# EAGLE design Pi-XO (EAGLE 9.2.2)
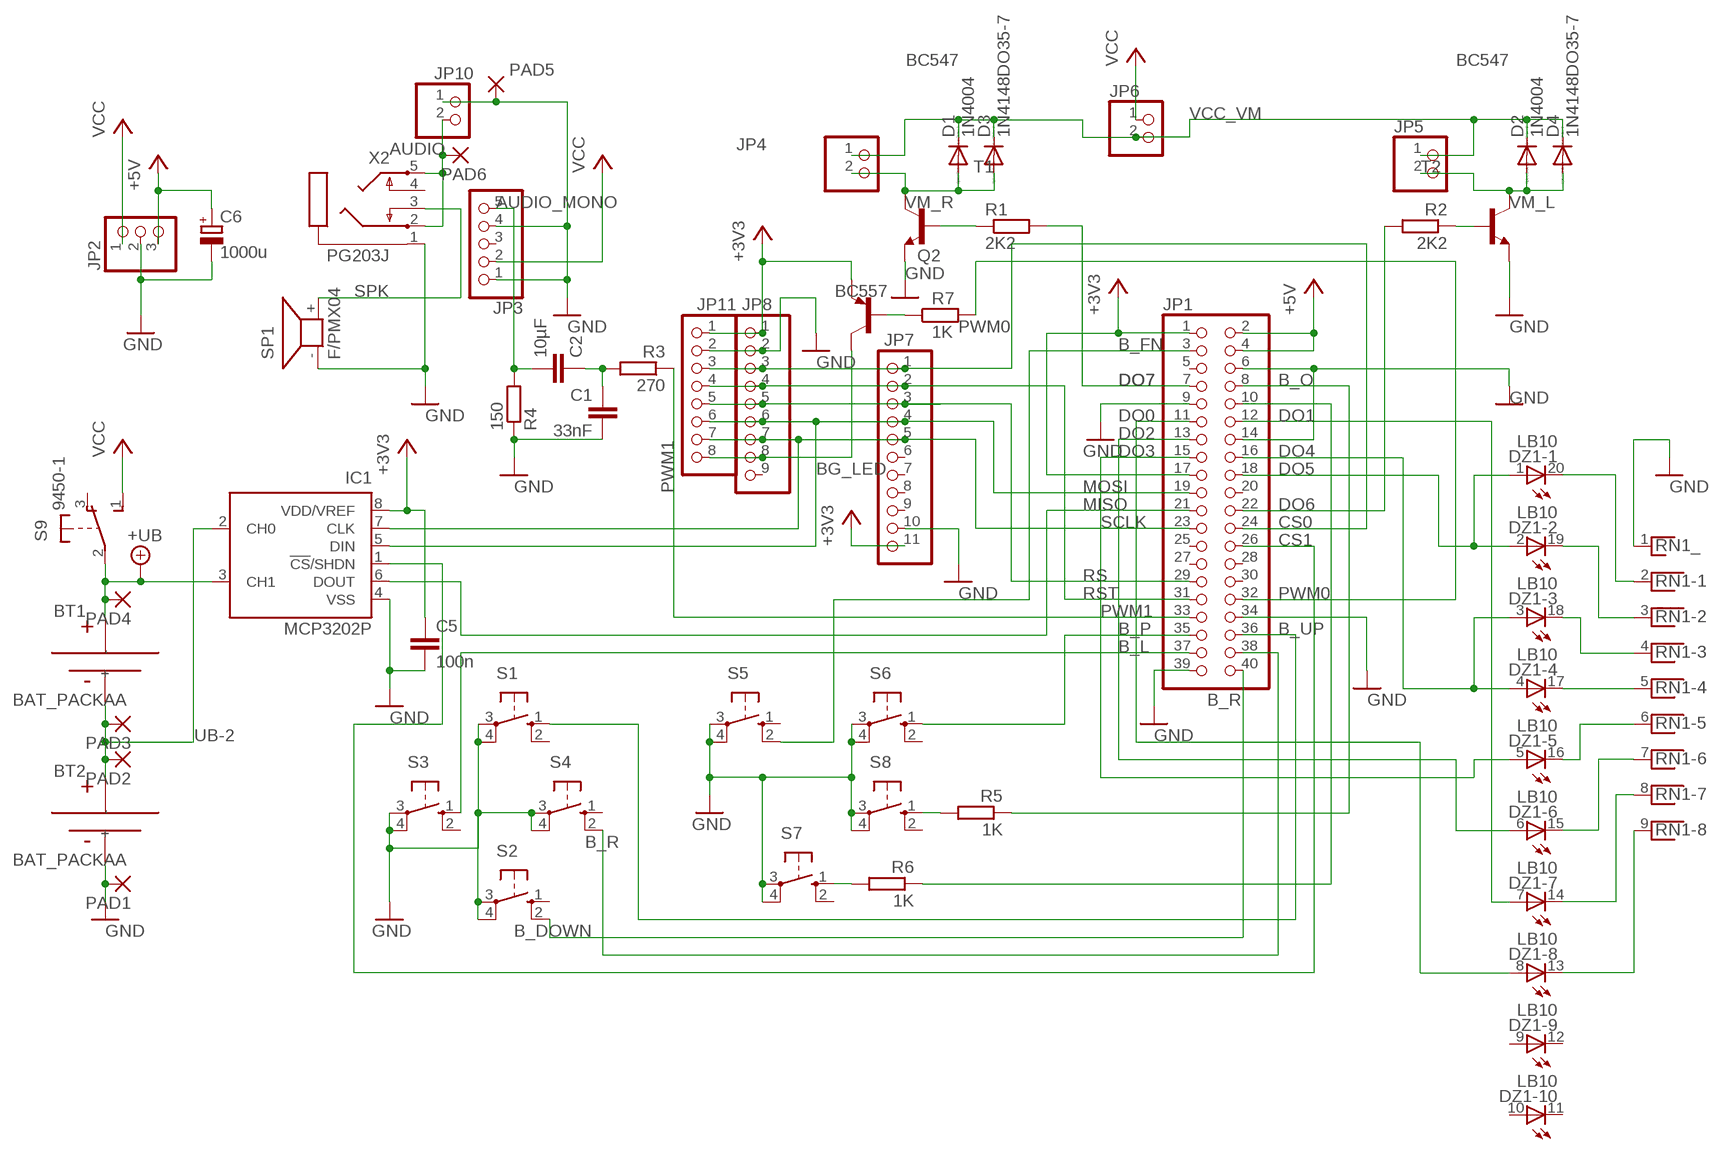
[diagram p0: schematic, sheet 1]

## Parts
BT1  BAT_PACKAA  [BHAA-3]
BT2  BAT_PACKAA  [BHAA-3]
C1  33nF  C-EU050-024X044  [C050-024X044]
C2  10µF  C-EU050-024X044  [C050-024X044]
C5  100n  C-EU025-030X050  [C025-030X050]
C6  1000u  CPOL-EUB45181A  [B45181A]
D1  1N4004  [DO41-10]
D2  1N4004  [DO41-10]
D3  1N4148DO35-7  [DO35-7]
D4  1N4148DO35-7  [DO35-7]
DZ1  LB10  [LB10]
IC1  MCP3202P  [DIL8]
JP1  PINHD-2X20  [2X20]
JP2  PINHD-1X3  [1X03]
JP3  PINHD-1X5  [1X05]
JP4  PINHD-1X2  [1X02]
JP5  PINHD-1X2  [1X02]
JP6  PINHD-1X2  [1X02]
JP7  PINHD-1X11  [1X11]
JP8  PINHD-1X9  [1X09]
JP10  PINHD-1X2  [1X02]
JP11  PINHD-1X8  [1X08]
PAD1  3,81/1,4  [3,81/1,4]
PAD2  3,81/1,4  [3,81/1,4]
PAD3  3,81/1,4  [3,81/1,4]
PAD4  3,81/1,4  [3,81/1,4]
PAD5  2,15/1,0  [2,15/1,0]
PAD6  2,15/1,0  [2,15/1,0]
Q2  BC557  [TO92]
R1  2K2  R-EU_0204/7  [0204/7]
R2  2K2  R-EU_0204/7  [0204/7]
R3  270  R-EU_0204/7  [0204/7]
R4  150  R-EU_0204/7  [0204/7]
R5  1K  R-EU_0204/7  [0204/7]
R6  1K  R-EU_0204/7  [0204/7]
R7  1K  R-EU_0204/7  [0204/7]
RN1  RNX8  [RN-9]
S1  10-XX  [B3F-10XX]
S2  10-XX  [B3F-10XX]
S3  10-XX  [B3F-10XX]
S4  10-XX  [B3F-10XX]
S5  10-XX  [B3F-10XX]
S6  10-XX  [B3F-10XX]
S7  10-XX  [B3F-10XX]
S8  10-XX  [B3F-10XX]
S9  9450-1  [9450-1]
SP1  F/PMX04  [F/PMX04A]
T1  BC547  [TO92]
T2  BC547  [TO92]
X2  PG203J  [PG203J]

## Nets
+3V3 [Low Power Supply]: C5.1 IC1.8(VDD/VREF) JP1.1 JP1.17 JP7.11 JP8.1 JP11.1 Q2.1(E)
+5V [Supply]: C6.+ JP1.2 JP1.4 JP2.3
+UB [Low Power Supply]: BT1.+ IC1.3(CH1) PAD4.1(P) S9.2(P)
AUDIO [Audio]: JP10.2 PAD6.1(P) X2.2 X2.5
AUDIO_MONO [Audio]: C2.2 JP3.5 R4.2
B_DOWN: JP1.40 S2.2(S1)
B_FN: JP1.3 S5.2(S1)
B_L: JP1.37 S3.1(S)
B_O: JP1.8 R5.1
B_P: JP1.35 S6.1(S)
B_R: JP1.38 S4.2(S1)
B_UP: JP1.36 S1.1(S)
B_X: JP1.10 R6.1
BG_LED: JP8.8 JP11.8 Q2.3(C)
CS0: JP1.24 JP7.1 JP8.3 JP11.3
CS1: IC1.1(!CS!/SHDN) JP1.26
DO0: DZ1.8(-8:A) JP1.11
DO1: DZ1.7(-7:A) JP1.12
DO2: DZ1.6(-6:A) JP1.13
DO3: DZ1.5(-5:A) JP1.15
DO4: DZ1.3(-3:A) DZ1.4(-4:A) JP1.16
DO5: DZ1.1(-1:A) DZ1.2(-2:A) JP1.18
DO6: JP1.22 R2.2
DO7: JP1.7 R1.2
GND [Supply]: BT2.- C1.2 C5.2 C6.- IC1.4(VSS) JP1.6 JP1.9 JP1.14 JP1.34 JP1.39 JP2.2 JP3.1 JP3.4 JP7.10 JP8.2 JP10.1 JP11.2 PAD1.1(P) PAD5.1(P) R4.1 RN1.1 S1.3(P) S1.4(P1) S2.3(P) S2.4(P1) S3.3(P) S3.4(P1) S4.3(P) S4.4(P1) S5.3(P) S5.4(P1) S6.3(P) S6.4(P1) S7.3(P) S7.4(P1) S8.3(P) S8.4(P1) SP1.- T1.1(E) T2.1(E) X2.1
MISO: IC1.6(DOUT) JP1.21
MOSI: IC1.5(DIN) JP1.19 JP7.4 JP8.6 JP11.6
N$2: C1.1 C2.1 R3.2
N$3: R1.1 T1.2(B)
N$6: R2.1 T2.2(B)
N$10: DZ1.20(-1:C) RN1.2
N$11: DZ1.19(-2:C) RN1.3
N$12: DZ1.18(-3:C) RN1.4
N$13: DZ1.17(-4:C) RN1.5
N$14: DZ1.16(-5:C) RN1.6
N$15: DZ1.15(-6:C) RN1.7
N$16: DZ1.14(-7:C) RN1.8
N$17: DZ1.13(-8:C) RN1.9
N$31: R5.2 S8.1(S)
N$34: R6.2 S7.1(S)
N$43: Q2.2(B) R7.1
PWM0: JP1.32 R7.2
PWM1 [Audio]: JP1.33 R3.1
RS: JP1.29 JP7.3 JP8.5 JP11.5
RST: JP1.31 JP7.2 JP8.4 JP11.4
SCLK: IC1.7(CLK) JP1.23 JP7.5 JP8.7 JP11.7
SPK [Audio]: SP1.+ X2.3
UB-2 [Supply]: BT1.- BT2.+ IC1.2(CH0) PAD2.1(P) PAD3.1(P)
VCC [Supply]: JP2.1 JP3.2 JP6.1 S9.1(S)
VCC_VM: D1.C D2.C D3.C D4.C JP4.1 JP5.1 JP6.2
VM_L: D2.A D4.A JP5.2 T2.3(C)
VM_R: D1.A D3.A JP4.2 T1.3(C)
Unconnected: DZ1.9(-9:A) DZ1.10(-10:A) DZ1.11(-10:C) DZ1.12(-9:C) JP1.5 JP1.20 JP1.25 JP1.27 JP1.28 JP1.30 JP3.3 JP7.6 JP7.7 JP7.8 JP7.9 JP8.9 S1.2(S1) S2.1(S) S3.2(S1) S4.1(S) S5.1(S) S6.2(S1) S7.2(S1) S8.2(S1) S9.3(O) X2.4

## Library data of the parts
BT1 BT2 = batteries2-eagle9:BAT_PACK: collection of battery footprints; DIGIKEY: BHAA-3-ND; MANUFACTURER: MPD; MPN: BHAA-3
C1 C2 C5 = rcl:C-EU: CAPACITOR, European symbol; SPICEPREFIX: C
C6 = rcl:CPOL-EU: POLARIZED CAPACITOR, European symbol; SPICEPREFIX: C
D1 D2 = diode:1N4004: DIODE general purpose rectifier, 1 A
D3 D4 = diode:1N4148: DIODE high speed (Philips)
DZ1 = led:LB10: LED BLOCK 10-LED bar graph, DIL, Siemens
IC1 = microchip:MCP3202: 2.7V Dual Channel 12-Bit A/D Converter with SPI Serial Interface Source: http://ww1.microchip.com/downloads/en/DeviceDoc/21034D.pdf; MF: MICROCHIP; MPN: MCP3202-CI/P; OC_FARNELL: 1196794; OC_NEWARK: 72K7287
JP1 = pinhead:PINHD-2X20: PIN HEADER
JP2 = pinhead:PINHD-1X3: PIN HEADER
JP3 = pinhead:PINHD-1X5: PIN HEADER
JP4-JP6 JP10 = pinhead:PINHD-1X2: PIN HEADER
JP7 = pinhead:PINHD-1X11: PIN HEADER
JP8 = pinhead:PINHD-1X9: PIN HEADER
JP11 = pinhead:PINHD-1X8: PIN HEADER
PAD1-PAD4 = wirepad:3,81/1,4: THROUGH-HOLE PAD
PAD5 PAD6 = wirepad:2,15/1,0: THROUGH-HOLE PAD
Q2 = transistor-pnp:BC557: PNP Transistor
R1-R7 = rcl:R-EU_: RESISTOR, European symbol; SPICEPREFIX: R
RN1 = resistor-net:RNX8: RESISTOR NETWORK; OC_FARNELL: unknown; OC_NEWARK: unknown
S1-S8 = switch-omron:10-XX: OMRON SWITCH; MPN: B3F-1000; OC_FARNELL: 176432; OC_NEWARK: 36M3542
S9 = switch-misc:9450-1: MARQUARDT SWITCH
SP1 = buzzer:F/PMX04: SPEAKER Source: Buerklin; OC_FARNELL: unknown; OC_NEWARK: unknown
T1 T2 = transistor:BC547: NPN TRANSISTOR
X2 = con-hirschmann:PG203J: MIC/HEADPHONE JACK KS-S stereo microphone/headphone jack PG203JN (Schukat); OC_FARNELL: unknown; OC_NEWARK: unknown

## Net classes
1 Supply: width 0.25 mm, drill 0.1 mm, clearance 0.25 mm
2 Low Power Supply: width 0.25 mm, drill 0.008 mm, clearance 0.2 mm
3 Audio: clearance 0.3 mm

## Board
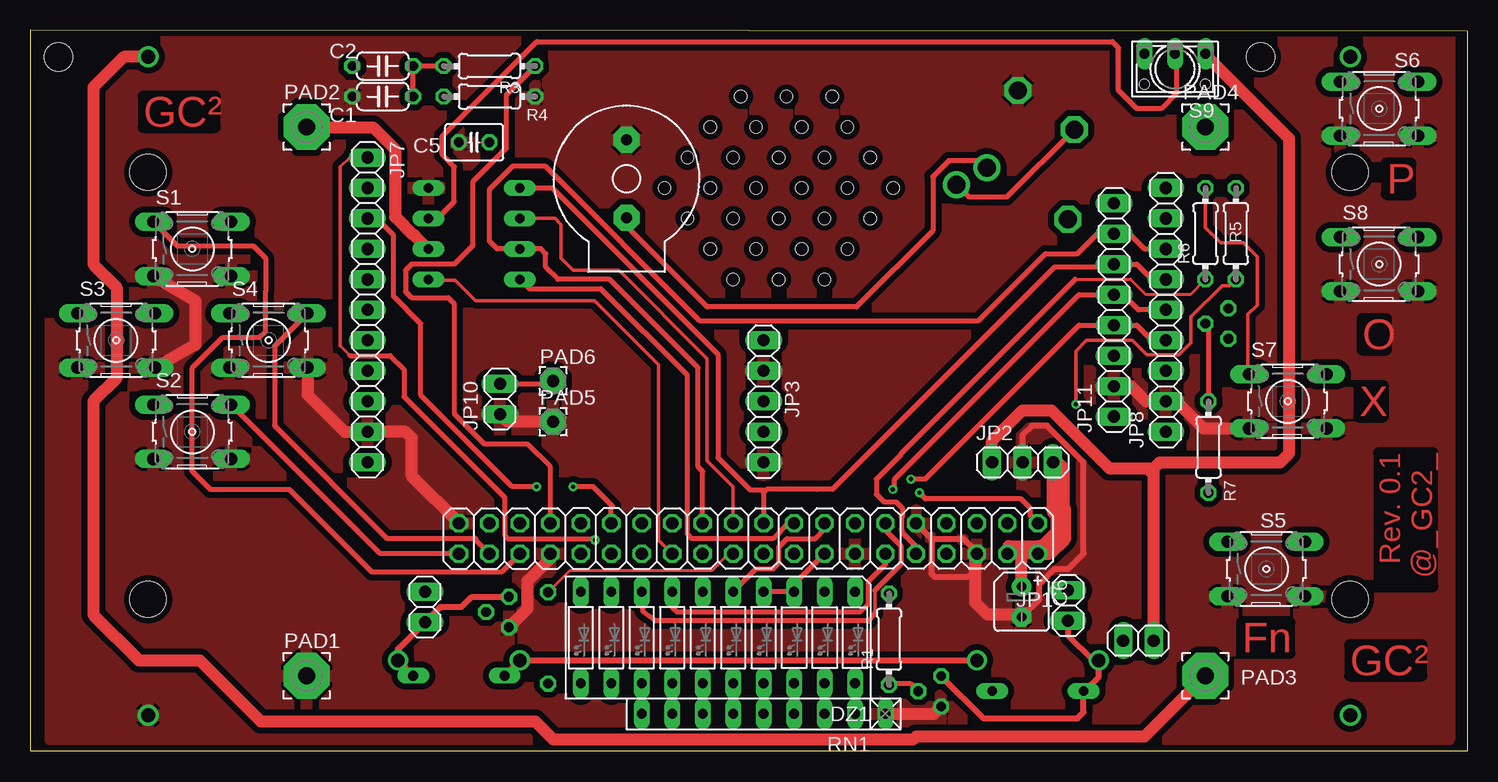
[diagram p1: board, top side]
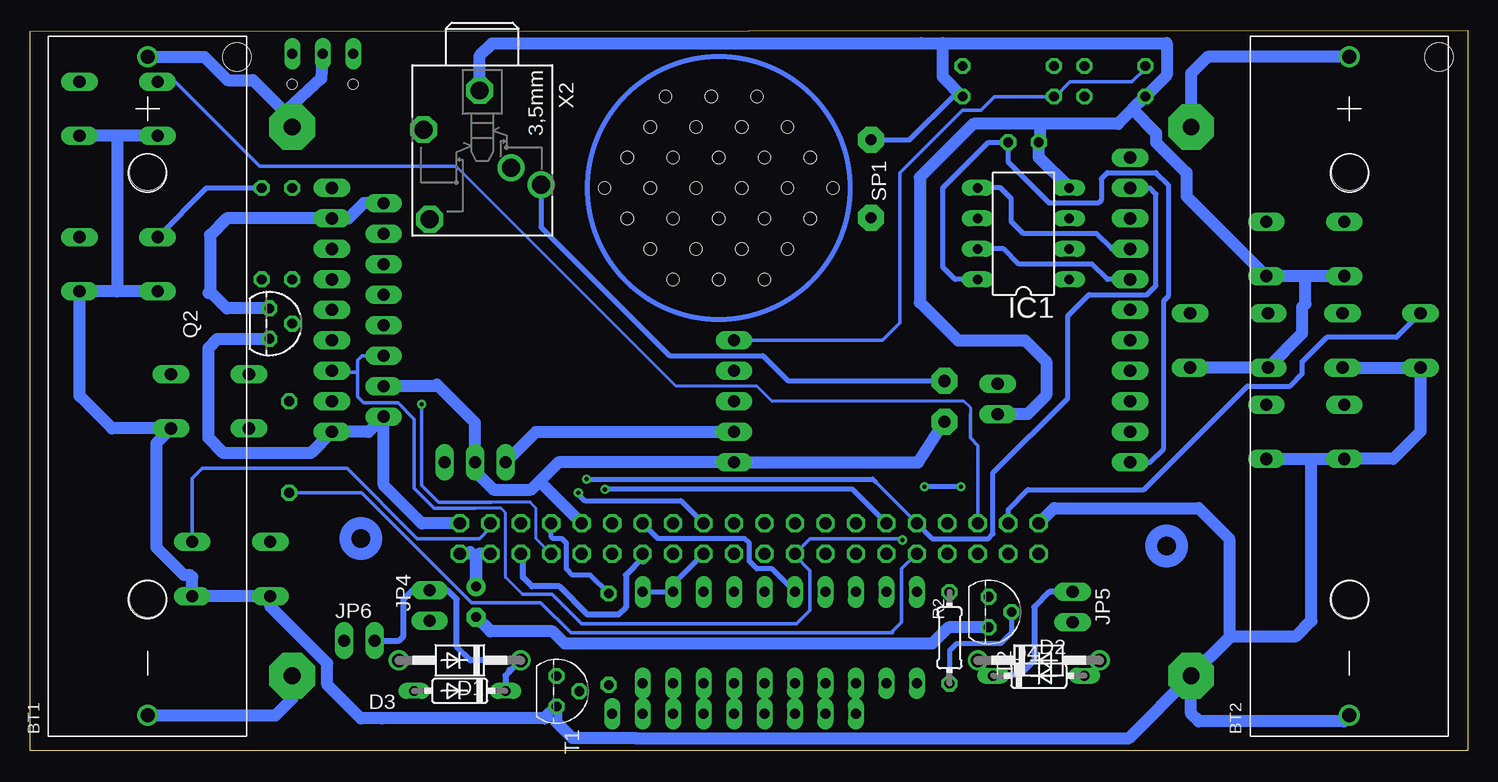
[diagram p2: board, bottom side, seen from below]

Size 119.84 x 60.05 mm. Coordinates in mm from the lower left corner, seen from the top.
Outline: 0,0 119.84,0 119.84,59.95 0,60.05 0,0
Copper layers (1*16): Top 0.035mm / dielectric 1.5mm / Bottom 0.035mm
Design rules "default *": minimum track width 6mil, minimum drill 0.35mm, track to track 6mil, track to pad 6mil, pad to pad 6mil, via to via 6mil, smd to smd 6mil, copper to edge 10mil, drill to drill 1mil, minimum pad ring 10mil, minimum via ring 8mil, stop-mask expansion 4mil, vias tented up to drill 0mil, thermal gap 10mil
Holes 3 mm at 110.04,48.21 110.04,12.61 9.84,12.61 9.84,48.21
Holes 1 mm at 56.71,51.97 60.52,51.97 64.33,51.97 68.14,51.97 66.87,54.51 63.06,54.51 59.25,54.51 70.05,49.43 66.23,49.43 62.43,49.43 58.62,49.43 54.8,49.43 56.71,46.89 60.52,46.89 64.33,46.89 68.14,46.89 70.05,44.35 66.23,44.35 62.43,44.35 58.62,44.35 54.8,44.35 56.71,41.81 60.52,41.81 64.33,41.81 68.14,41.81 66.23,39.27 62.43,39.27 58.62,39.27 52.9,46.89 71.95,46.89

### Footprints (pad centres in the part's own frame; a part is rotated, then mirrored left to right if it is on the bottom)
BHAA-3 = drill 1.17: + 27.43,0; - -27.43,0 | hole 2.36: 27.43,-7.47
C050-024X044 = drill 0.813 octagon: 1 -2.54,0; 2 2.54,0
C025-030X050 = drill 0.813 octagon: 1 -1.27,0; 2 1.27,0
B45181A = drill 0.813 pad 1.6: + -1.27,0 | drill 0.813 pad 1.6 octagon: - 1.27,0
DO41-10 = drill 1.118: A 5.08,0; C -5.08,0
DO35-7 = drill 0.813 long: A 3.81,0; C -3.81,0
LB10 = drill 0.813 long: 1 -11.43,-3.81; 2 -8.89,-3.81; 3 -6.35,-3.81; 4 -3.81,-3.81; 5 -1.27,-3.81; 6 1.27,-3.81; 7 3.81,-3.81; 8 6.35,-3.81; 9 8.89,-3.81; 10 11.43,-3.81; 11 11.43,3.81; 12 8.89,3.81; 13 6.35,3.81; 14 3.81,3.81; 15 1.27,3.81; 16 -1.27,3.81; 17 -3.81,3.81; 18 -6.35,3.81; 19 -8.89,3.81; 20 -11.43,3.81
DIL8 = drill 0.813 long: 1 -3.81,-3.81; 2 -1.27,-3.81; 3 1.27,-3.81; 4 3.81,-3.81; 5 3.81,3.81; 6 1.27,3.81; 7 -1.27,3.81; 8 -3.81,3.81
2X20 = drill 1.016 octagon: 1 -24.13,-1.27; 2 -24.13,1.27; 3 -21.59,-1.27; 4 -21.59,1.27; 5 -19.05,-1.27; 6 -19.05,1.27; 7 -16.51,-1.27; 8 -16.51,1.27; 9 -13.97,-1.27; 10 -13.97,1.27; 11 -11.43,-1.27; 12 -11.43,1.27; 13 -8.89,-1.27; 14 -8.89,1.27; 15 -6.35,-1.27; 16 -6.35,1.27; 17 -3.81,-1.27; 18 -3.81,1.27; 19 -1.27,-1.27; 20 -1.27,1.27; 21 1.27,-1.27; 22 1.27,1.27; 23 3.81,-1.27; 24 3.81,1.27; 25 6.35,-1.27; 26 6.35,1.27; 27 8.89,-1.27; 28 8.89,1.27; 29 11.43,-1.27; 30 11.43,1.27; 31 13.97,-1.27; 32 13.97,1.27; 33 16.51,-1.27; 34 16.51,1.27; 35 19.05,-1.27; 36 19.05,1.27; 37 21.59,-1.27; 38 21.59,1.27; 39 24.13,-1.27; 40 24.13,1.27
1X03 = drill 1.016 long: 1 -2.54,0; 2 0,0; 3 2.54,0
1X05 = drill 1.016 long: 1 -5.08,0; 2 -2.54,0; 3 0,0; 4 2.54,0; 5 5.08,0
1X02 = drill 1.016 long: 1 -1.27,0; 2 1.27,0
1X11 = drill 1.016 long: 1 -12.7,0; 2 -10.16,0; 3 -7.62,0; 4 -5.08,0; 5 -2.54,0; 6 0,0; 7 2.54,0; 8 5.08,0; 9 7.62,0; 10 10.16,0; 11 12.7,0
1X09 = drill 1.016 long: 1 -10.16,0; 2 -7.62,0; 3 -5.08,0; 4 -2.54,0; 5 0,0; 6 2.54,0; 7 5.08,0; 8 7.62,0; 9 10.16,0
1X08 = drill 1.016 long: 1 -8.89,0; 2 -6.35,0; 3 -3.81,0; 4 -1.27,0; 5 1.27,0; 6 3.81,0; 7 6.35,0; 8 8.89,0
3,81/1,4 = drill 1.397 pad 3.81 octagon: 1 0,0
2,15/1,0 = drill 1.016 pad 2.159 octagon: 1 0,0
TO92 = drill 0.813 octagon: 1 1.27,0; 2 0,1.905; 3 -1.27,0
0204/7 = drill 0.813 octagon: 1 -3.81,0; 2 3.81,0
RN-9 = drill 0.813 long: 1 -10.16,0; 2 -7.62,0; 3 -5.08,0; 4 -2.54,0; 5 0,0; 6 2.54,0; 7 5.08,0; 8 7.62,0; 9 10.16,0
B3F-10XX = drill 1.016 long: 1 -3.251,2.261; 2 3.251,2.261; 3 -3.251,-2.261; 4 3.251,-2.261
9450-1 = drill 0.813 long: 1 -2.54,-1.27; 2 0,-1.27; 3 2.54,-1.27 | hole 0.813: 2.54,1.27; -2.54,1.27
F/PMX04A = drill 0.914 pad 2.159 octagon: + 3.251,0; - -3.251,0
PG203J = drill 1.499 octagon: 1 -5.004,-0.203; 4 5.74,-4.369; 5 -1.753,-4.902 | drill 1.499: 2 2.845,4.902; 3 1.448,2.388

### Placement (x,y rotation side)
BT1  110.05,30.38 90 bottom
BT2  9.86,30.38 90 bottom
C1  29.4,54.51 180 top
C2  29.4,57.05 180 top
C5  37.03,50.7 180 top
C6  82.66,12.4 270 top
D1  84.02,7.52 180 bottom
D2  35.76,7.52 0 bottom
D3  84.02,4.98 180 bottom
D4  35.76,6.25 0 bottom
DZ1  57.34,9.43 180 top
IC1  37.03,43.08 90 bottom
JP1  59.89,17.68 180 top
JP2  82.75,24.03 0 top
JP3  61.16,29.11 90 top
JP4  86.53,12.09 270 top
JP5  32.93,11.97 270 top
JP6  92.4,9.17 180 top
JP7  28.13,36.73 270 top
JP8  94.68,36.73 90 top
JP10  39.18,29.31 90 top
JP11  90.37,36.73 90 top
PAD1  23.05,6.25 0 top
PAD2  23.05,51.97 0 top
PAD3  97.98,6.25 0 top
PAD4  97.98,51.97 0 top
PAD5  43.61,27.41 0 top
PAD6  43.61,30.81 0 top
Q2  99.89,35.59 270 bottom
R1  71.61,9.29 90 top
R2  43.2,9.4 90 bottom
R3  38.3,57.05 180 top
R4  38.3,54.51 180 top
R5  100.53,43.08 90 top
R6  97.98,43.08 90 top
R7  98.24,25.3 270 top
RN1  61.16,3.07 180 top
S1  13.53,41.81 0 top
S2  13.53,26.57 0 top
S3  7.18,34.19 0 top
S4  19.88,34.19 0 top
S5  103.06,15.14 0 top
S6  112.46,53.49 0 top
S7  104.84,29.11 0 top
S8  112.46,40.54 0 top
S9  95.45,56.8 180 top
SP1  49.73,47.65 270 top
T1  75.95,4.95 270 bottom
T2  39.93,11.55 270 bottom
X2  82.14,50.01 270 bottom

### Tracks (layer width: path | path; a pad name or v marks a point on that pad's centre or on a via)
+3V3  (via drill 0.35)
  Top 0.406: IC1.8 41.6,38.51 47.57,38.51 54.8,31.27 54.8,18.06 55.19,17.68 61.92,17.68 63.19,18.95 JP1.17 | JP1.1 83.38,19.58 83.38,20.22 82.62,20.98 74.64,20.98 v74.13,21.49
  Bottom 0.25: 40.86,39.3 IC1.8 | 28.13,24.05 JP7.11 | 99.87,34.32 Q2.1 | 94.73,26.57 JP8.1 94.58,26.57 | 90.35,27.8 JP11.1
  Bottom 0.406: IC1.8 42.74,39.27 43.76,40.29 43.76,46.89 39.95,50.7 C5.1 38.3,49.05 34.87,45.62 30.8,45.62 30.55,45.87 30.55,47.65 30.04,48.16 25.98,48.16 24.96,47.14 24.96,37.87 25.34,37.49 25.34,25.17 26.48,24.03 JP7.11 | JP1.17 65.59,20.84 73.63,20.84 74.2,21.42 v74.13,21.49
  Bottom 1: 90.35,27.8 90.35,22.11 87.19,18.95 JP1.1 | JP11.1 91.64,26.57 94.58,26.57
  Bottom 1.016: JP8.1 96.46,24.79 103.7,24.79 104.97,26.06 104.97,33.55 104.21,34.32 Q2.1
+5V
  Top 1: JP1.4 81.48,16.43 82.75,16.43 83.99,16.43 JP1.2 84.22,16.89 85.59,18.26 85.59,19.56 85.28,19.86 JP2.3
  Top 1.016: JP1.2 85.03,16.41 86.3,17.68 86.3,20.09 86.17,20.22 86.17,23.52 85.67,24.03 JP2.3 | JP1.4 81.6,16.54 81.6,17.04 84.07,17.04 84.22,16.89 | 82.69,13.7 C6.+ 82.66,16.35 82.75,16.43
  Bottom 1.016: JP1.4 82.36,16.41 82.66,16.11 C6.+ 82.66,16.07 83.13,16.54 83.25,16.41 JP1.2
+UB
  Top 0.25: 95.42,58.04 S9.2
  Top 0.406: S9.2 95.57,57.95 95.57,54.76 94.3,53.49 92.27,53.49 90.75,55.02 90.75,58.57 90.24,59.08 42.23,59.08 34.36,51.21 34.36,49.68 35.37,48.67 35.37,45.75 33.98,44.35 IC1.3
  Bottom 0.25: 98.41,53.41 PAD4.1
  Bottom 1: BT1.+ 105.31,57.81 103.38,55.88 101.26,55.88 97.98,52.6 PAD4.1 | S9.2 95.57,56.03 98.41,53.41
AUDIO
  Top 0.152: 39.18,30.61 JP10.2 | 43.6,30.76 PAD6.1 | 77.28,47.14 X2.2 | 87.04,51.72 X2.5
  Top 0.406: X2.5 81.41,46.13 78.3,46.13 77.28,47.14 | JP10.2 43.42,30.58 43.6,30.76
  Bottom 0.152: 43.68,30.84 PAD6.1
  Bottom 0.406: 43.68,30.84 56.66,30.84 58.74,32.92 66.54,32.92 77.24,43.62 X2.2
AUDIO_MONO
  Bottom 0.152: R4.2 34.54,54.46 34.59,54.51
  Bottom 0.305: R4.2 34.36,54.51 33.14,55.73 27.98,55.73 26.86,56.85 C2.2 | JP3.5 48.79,34.19 47.31,35.66 47.31,48.16 42.11,53.37 40.58,53.37 39.44,54.51 34.59,54.51
B_DOWN
  Top 0.406: JP1.40 29.2,16.41 S2.2
B_FN
  Bottom 0.305: JP1.3 81.48,18.57 82.36,17.68 87.57,17.68 93.41,23.52 105.48,23.52 106.32,22.68 S5.2
B_L
  Bottom 0.406: S3.1 5.93,34.44 11.75,34.44 13.78,32.41 13.78,31.4 14.8,30.38 18.36,30.38 26.99,21.74 36.64,21.74 38.3,20.09 JP1.37
B_O  (via drill 0.35)
  Top 0.305: R5.1 100.02,38.76 99.38,38.76 96.77,36.15 96.77,34 95.76,33 93.1,33 91.9,34.19 88.08,34.19 87.19,33.3 v87.19,28.86
  Bottom 0.152: 100.53,39.22 R5.1 | 76.45,16.43 JP1.8
  Bottom 0.254: JP1.8 77.67,17.68 77.67,20.22 78.15,20.7 81.35,20.7
  Bottom 0.305: 81.35,20.7 85.77,20.7 87.19,22.12 v87.19,28.86
B_P
  Bottom 0.254: 41.47,28.09 41.47,28.6 41.98,29.11 57.98,29.11 59.25,30.38 65.98,30.38 84.32,48.72
  Bottom 0.305: 84.32,48.72 100.7,48.72 107.74,55.75 S6.1 | JP1.35 40.84,25.43 41.47,26.06 41.47,28.09
B_R
  Top 0.406: JP1.38 37.15,17.55 37.15,17.68 29.79,17.68 20.39,27.08 20.39,33.71 S4.2
  Bottom 0.152: 23.18,36.4 S4.2
B_UP
  Top 0.152: 10.3,43.71 10.3,44.02 S1.1 | 40.78,16.43 JP1.36
  Top 0.406: JP1.36 39.31,14.89 28.52,14.89 21.66,21.74 15.05,21.74 13.53,23.27 13.53,31.9 16.07,34.44 19.12,34.44 19.63,34.95 19.63,38 19.63,38.25 19.63,41.05 18.61,42.06 12.29,42.06 S1.1
B_X
  Top 0.254: 87.14,39.3 91.74,39.3 93.03,38 96.72,38 R6.1 | 72.59,24.74 72.59,24.66
  Top 0.406: 72.59,24.74 87.14,39.3 | 72.59,24.66 70.55,22.63 70.55,21.36 71.19,20.73 72.2,20.73 72.71,20.22 72.71,19.53 72.64,19.45 72.64,18.45 72.68,18.41 72.68,18.22 73.86,17.04 JP1.10
BG_LED
  Bottom 1.016: 104.84,38.25 104.84,42.95 103.45,44.35 JP8.8 93.29,44.35 92.02,45.62 JP11.8 | 104.84,38.25 104.97,38.13 | Q2.3 103.45,36.86 104.84,38.25
CS0  (via drill 0.35)
  Top 0.254: JP7.1 26.66,49.43 25.87,48.64 | 25.87,33.73 26.69,32.92 | v47.11,17.55 46.98,17.68
  Top 0.305: 25.87,33.73 25.87,48.64
  Top 0.406: 26.69,32.92 30.04,32.92 31.18,31.78 31.18,29.49 39.57,21.11 39.57,17.93 39.87,17.62 47.04,17.62 v47.11,17.55
  Bottom 0.152: 56.02,16.36 JP1.24 | 90.31,32.89 JP11.3
  Bottom 0.254: 78.79,13.03 80.2,14.45 80.2,19.84 80.59,20.22 82.75,20.22
  Bottom 0.305: v47.11,17.55 47.24,17.68 54.8,17.68 JP1.24 56.08,16.28 54.8,15.01 54.8,11.71 55.95,10.57 73.86,10.57 76.32,13.03 78.28,13.03 | 78.28,13.03 78.79,13.03 | 78.28,13.03 78.3,13.05 | 82.75,20.22 86.17,20.22 87.83,21.88 87.83,27.64 89.17,28.98 92.02,28.98 92.52,29.49 92.52,31.52 | 92.52,31.52 92.52,32.54 92.14,32.92 JP11.3 | JP8.3 94.56,31.52 92.52,31.52
CS1
  Top 0.152: 33.24,39.22 IC1.1
  Top 0.305: JP1.26 52.39,17.55 52.39,22.25 52.39,22.51 52.39,32.16 47.06,37.49 37.15,37.49 35.43,39.22 33.24,39.22
DO0
  Top 0.305: 70.43,13.36 70.43,11.46
  Top 0.406: 70.43,13.36 70.93,13.87 70.94,13.87 72.59,15.52 72.59,17.09 71.31,18.36 JP1.11 | 70.43,11.46 69.92,10.82 52.14,10.82 51.12,11.58 DZ1.8
DO1
  Top 0.406: JP1.12 71.31,15.52 69.87,14.07 69.87,12.22 69.21,11.56 68.65,11.56 53.94,11.56 53.54,11.96 DZ1.7
DO2
  Bottom 0.152: 56.1,13.26 DZ1.6
  Bottom 0.406: DZ1.6 57.98,15.14 59.25,15.14 59.89,15.78 59.89,17.3 60.27,17.68 67.5,17.68 JP1.13
DO3
  Top 0.406: DZ1.5 60.52,15.14 61.92,15.14 62.43,15.65 62.43,16.98 63.12,17.68 65.47,17.68 66.23,18.44 JP1.15
DO4
  Top 0.406: JP1.16 63.7,13.87 DZ1.3 DZ1.4
DO5
  Bottom 0.406: DZ1.1 DZ1.2 66.23,13.87 JP1.18
DO6
  Top 0.152: 58.62,16.36 JP1.22
  Top 0.254: JP1.22 58.23,16.41 56.84,15.01 45,15.01 R2.2
  Bottom 0.152: 58.62,16.36 JP1.22
DO7
  Top 0.152: R1.2 71.66,13.16
  Bottom 0.406: R1.2 73.14,14.63 74.62,14.63 75.12,15.14 75.12,17.3 75.51,17.68 76.27,17.68 76.39,17.81 JP1.7
GND
  Top 0.508: JP1.9 75.12,17.68 | 75.12,17.68 77.79,17.68 78.81,16.66 78.81,16.28 | C6.- 84.14,12.61 84.14,13.87 85.41,15.14 86.56,15.14 87.83,16.41 87.83,24.04 84.79,27.08 83.51,27.08 82.75,26.32 JP2.2 | 75.12,17.68 75.12,14.76 75.38,14.51 78.17,14.51 78.81,15.14
  Top 1: T2.1 41.47,11.83 41.47,14.12 43.38,16.03 JP1.34 | 82.87,23.9 JP2.2 | S1.3 13.78,37.49 13.78,33.81 S3.4 | C6.- 82.46,11.33 79.82,11.33 78.81,12.35 78.81,15.14 78.81,16.28 JP1.6 | RN1.1 75.35,3.07 T1.1 | S4.4 23.13,29.67 26.23,26.57 JP7.10 31.31,26.57 31.82,26.06 31.82,22.89 JP1.39 | PAD5.1 39.8,27.41 JP10.1 | 94.73,29.16 JP8.2 94.73,29.16
  Top 1.016: S7.3 97.83,26.85 95.57,29.11 JP8.2 93.03,29.11 91.76,30.38 JP11.2
  Bottom 0.406: SP1.- 46.51,50.9 42.91,54.51 R4.1
  Bottom 0.508: 68.78,16.03 70.17,14.63 70.17,11.96 70.81,11.33 73.35,11.33 75.7,13.69 78.01,13.69 78.75,14.43 78.75,16.23 JP1.6
  Bottom 1: PAD1.1 23.05,3.07 22.42,2.44 10.37,2.44 BT2.- | S3.4 S3.3 3.93,26.59 6.21,24.31 S2.3 13.02,24.31 | 27.94,53.43 C1.2 25.09,56.29 25.09,58.95 43.76,58.95 | 27.94,53.43 29.15,52.22 35.63,52.22 | 35.63,52.22 41.22,52.22 45.66,47.78 45.66,37.37 42.49,34.19 36.9,34.19 35.12,32.41 35.12,29.62 36.7,28.04 JP10.1 | S1.3 13.53,39.55 | 13.53,39.55 S1.4 23.44,46.2 23.44,48.16 25.98,50.7 25.98,51.46 27.94,53.43 | S8.3 112.59,38.28 | 112.59,38.28 S8.4 115.71,29.57 113,26.85 S7.4 | S6.3 112.59,51.23 | 112.59,51.23 S6.4 | S5.3 S5.4 | PAD5.1 45.79,24.03 JP3.1 75.78,24.03 77.61,22.2 78.06,21.76 81.21,21.76 82.75,23.29 JP2.2 | 90.49,2.69 76.94,2.69 T1.1 75.95,2.38 74.62,1.04 69.4,1.04 69.36,1 28.3,1 PAD1.1 | X2.1 82.35,57.93 81.33,58.95 45.54,58.95 45.53,58.95 43.76,58.95 | 112.59,51.23 112.59,38.28 | T2.1 43.28,10.28 44.65,8.92 75.25,8.92 76.27,9.93 81.46,9.93 C6.- | 13.53,39.55 13.53,37.24 13.78,36.98 13.78,34.77 S4.3 S4.4 | S2.4 13.02,24.31 | PAD1.1 19.75,9.55 14.29,9.55 13.02,10.82 13.02,24.31 | R4.1 43.76,56.16 43.76,58.95 | IC1.4 35.76,49.43 C5.2 35.63,50.83 35.63,52.22 | 68.78,16.03 JP1.14
  Bottom 1.016: 77.61,22.2 77.11,22.2 JP1.9 | JP2.2 82.75,27.33 85.92,30.51 86.05,30.38 JP11.2 | S5.4 106.32,14.45 106.49,14.63 107,14.63 109.29,16.92 109.29,25.66 S7.4 | S5.3 99.81,12.02 95.06,7.27 95.06,5.49 92.27,2.69 90.49,2.69 | JP1.39 34.48,20.22 22.42,20.22 19.88,17.68 19.88,9.43 PAD1.1
  pour Top (isolate 0.5): 1.72,59.59 118.31,59.59 118.31,0.92 1.72,0.92
MISO
  Top 0.305: IC1.6 43.76,44.35 44.26,43.84 44.26,41.05 45.28,40.03 49.09,40.03 56.46,32.67 56.46,24.16 58.62,22 JP1.21
MOSI
  Top 0.152: 61.13,21.49 61.13,21.69 61.09,21.73 61.13,21.77 65.6,21.77 65.93,21.77 | 61.13,19.2 61.13,18.95 JP1.19 | 40.86,46.84 IC1.5 | 90.39,40.59 JP11.6
  Top 0.406: 61.13,19.2 61.13,21.49 61.41,21.77 65.6,21.77 66.89,21.77 85.41,40.29 90.11,40.29 JP11.6 92.27,40.54 93.54,39.27 JP8.6 | 61.09,21.73 60.03,21.73 57.34,24.41 57.34,33.05 43.5,46.89 IC1.5
  Bottom 0.152: 40.78,46.84 IC1.5
  Bottom 0.406: IC1.5 38.93,46.89 38.04,46 38.04,44.1 37.03,43.08 30.93,43.08 29.66,41.81 JP7.4
N$2
  Top 0.406: C1.1 C2.1 R3.2
N$3
  Top 0.406: R1.1 71.74,5.62 73.39,5.62 T1.2
N$6
  Bottom 0.152: 43.15,5.62 R2.1 | 38.04,11.48 T2.2
  Bottom 0.406: T2.2 38.02,9.83 38.93,8.92 42.61,8.92 43.2,8.34 R2.1
N$10
  Top 0.152: RN1.2 68.75,3.1 68.75,5.62 DZ1.20
N$11
  Top 0.152: DZ1.19 RN1.3
N$12
  Top 0.152: RN1.4 63.72,3.1 63.72,5.62 DZ1.18
N$13
  Top 0.152: RN1.5 61.13,3.1 61.13,5.62 DZ1.17
N$14
  Top 0.152: DZ1.16 RN1.6
N$15
  Top 0.152: RN1.7 56.1,3.1 56.1,5.62 DZ1.15
N$16
  Top 0.152: RN1.8 53.51,3.1 53.51,5.62 DZ1.14
N$17
  Top 0.152: DZ1.13 RN1.9
N$31
  Top 0.152: 100.53,46.84 R5.2
  Bottom 0.406: S8.1 105.12,46.89 R5.2
N$34
  Top 0.152: 98.01,46.84 R6.2
  Top 0.305: R6.2 97.98,43.59 99.25,42.32 101.16,42.32 102.3,41.17 102.3,37.11 101.54,36.35 101.54,31.42 S7.1
N$43
  Top 0.406: R7.1 98.24,35.33 Q2.2
PWM0
  Bottom 0.305: JP1.32 47.19,15.14 47.19,10.7 47.95,9.93 47.95,9.82 74.76,9.82 77.27,12.33 83.05,12.33 92.21,21.49 R7.2
PWM1
  Top 0.406: JP1.33 43.38,23.65 41.47,25.55 37.91,25.55 35.37,28.09 35.37,37.24 34.87,37.75 31.82,37.75 31.31,38.25 31.31,40.03 31.82,40.54 35.37,40.54 36.9,42.06 36.9,47.4 39.69,50.19 39.69,54.64 R3.1
RS  (via drill 0.35)
  Top 0.254: 72.08,21.92 v71.92,21.77
  Top 0.406: 72.08,21.92 72.08,22.63 87.44,38 JP11.5 91.13,38 92.4,36.73 JP8.5 | v42.23,22 40.2,22 32.58,29.62 32.58,35.59 30.29,37.87 30.29,42.95 28.9,44.35 JP7.3 | JP1.29 48.46,20.22 48.58,20.35 46.93,22 v45.28,22
  Bottom 0.406: v42.23,22 v45.28,22 | v71.92,21.77 51.27,21.77 JP1.29
RST  (via drill 0.35)
  Top 0.406: v73.45,22.63 74.62,22.63 87.44,35.46 JP11.4 92.27,35.46 93.54,34.19 JP8.4
  Bottom 0.152: 28.13,46.53 JP7.2 | 45.89,18.95 JP1.31 45.97,18.95
  Bottom 0.305: JP1.31 49.41,22.44
  Bottom 0.406: JP7.2 26.48,46.89 25.98,46.38 25.98,38.76 26.74,38 31.56,38 33.34,36.22 33.34,29.36 39.57,23.14 39.57,18.06 39.95,17.68 44.65,17.68 JP1.31 | v73.45,22.63 49.6,22.63 49.41,22.44
SCLK
  Top 0.152: 90.31,43.03 JP11.7
  Top 0.406: JP1.23 56.08,23.27 55.69,23.65 55.69,31.9 48.33,39.27 44.01,39.27 42.99,40.29 42.99,41.43 42.61,41.81 IC1.7 38.93,41.81 38.3,42.45 38.3,46.78 40.26,48.74 42.92,48.74 55.82,35.84 79.06,35.84 84.65,41.43 87.32,41.43 88.97,43.08 JP11.7 91.64,43.08 92.91,41.81 JP8.7
  Bottom 0.152: 90.39,43.03 JP11.7 | 28.13,39.3 JP7.5
  Bottom 0.406: JP7.5 30.04,39.27 31.31,40.54 37.41,40.54 38.68,41.81 IC1.7
SPK
  Top 0.152: 79.72,48.59 X2.3
  Top 0.406: 79.72,48.59 79.14,49.18 76.6,49.18 75.25,47.83 75.25,43.33 68.9,36.98 56.46,36.98 49.73,43.71 SP1.+
UB-2
  Top 1: PAD3.1 92.91,1.17 73.86,1.17 73.6,0.92 43.63,0.92 42.11,2.44 19.24,2.44 14.17,7.52 9.09,7.52 5.27,11.33 5.27,29.11 7.21,31.05 7.21,38.6 5.27,40.54 5.27,55.27 7.81,57.81 BT2.+ | IC1.2 33.16,41.81 32.02,42.95 31.94,42.95 30.42,44.48 30.42,50.12 28.59,51.95 23.11,51.95 PAD2.1
  Bottom 1: BT1.- 99.38,2.95 97.98,4.35 PAD3.1 | BT2.+ 21.66,57.81 23.05,56.41 PAD2.1
VCC
  Top 1: JP2.1 80.2,25.81 82.75,28.35 85.16,28.35 89.98,23.52 93.16,23.52 | 93.16,23.52 93.67,23.52 JP6.1 | 104.46,24.28 104.97,24.79 104.97,51 97.98,57.99 S9.1 | 93.41,23.27 93.16,23.52
  Top 1.016: 93.41,23.27 93.67,23.52 94.17,24.03 104.21,24.03 104.46,24.28
  Bottom 1: JP3.2 77.67,26.57 JP2.1
VCC_VM
  Top 0.152: 40.78,7.52 D2.C | 78.68,7.52 D1.C
  Top 0.508: D4.C 40.78,7.47 40.78,7.52 | D2.C 78.68,7.52
  Bottom 0.152: 39.57,6.3 D4.C | D3.C 80.18,5.01 80.18,6.3 78.96,7.52 D1.C | 86.5,13.31 JP4.1
  Bottom 0.508: 39.57,6.6 39.57,6.3 37.36,6.3 36.14,7.52 36.14,11.96 34.86,13.24 JP5.1 | 79.89,6.57 D1.C 83.13,7.52 84.27,8.66 84.27,12.6 85.03,13.36 JP4.1 87.95,13.36 88.71,12.6 88.71,9.55 89.09,9.17 JP6.2 | 79.89,6.57 80.2,6.25 D3.C | 79.89,6.72 79.89,6.57
  Bottom 1: 86.99,13.31 86.5,13.31
VM_L
  Top 0.152: 32.94,10.72 JP5.2 32.86,10.64 30.84,8.62
  Top 0.508: D4.A D2.A 30.67,8.46 30.84,8.62 32.94,10.72 | JP5.2 34.19,11.96 35.96,11.96 36.77,12.78 39.88,12.78 T2.3
VM_R
  Top 0.152: 75.99,6.23 T1.3 | 89.02,7.52 D1.A
  Top 0.508: T1.3 79.48,2.69 87.32,2.69 87.83,3.2 D3.A 87.95,4.98 89.09,6.12 D1.A | JP4.2 86.53,9.58 88.59,7.52 89.02,7.52
(copper drawn outside any net)
  shapes: Bottom circle x3

### Text on the board
Top: GC² | P | O | X | Rev. 0.1 / @_GC2_ | Fn | GC²